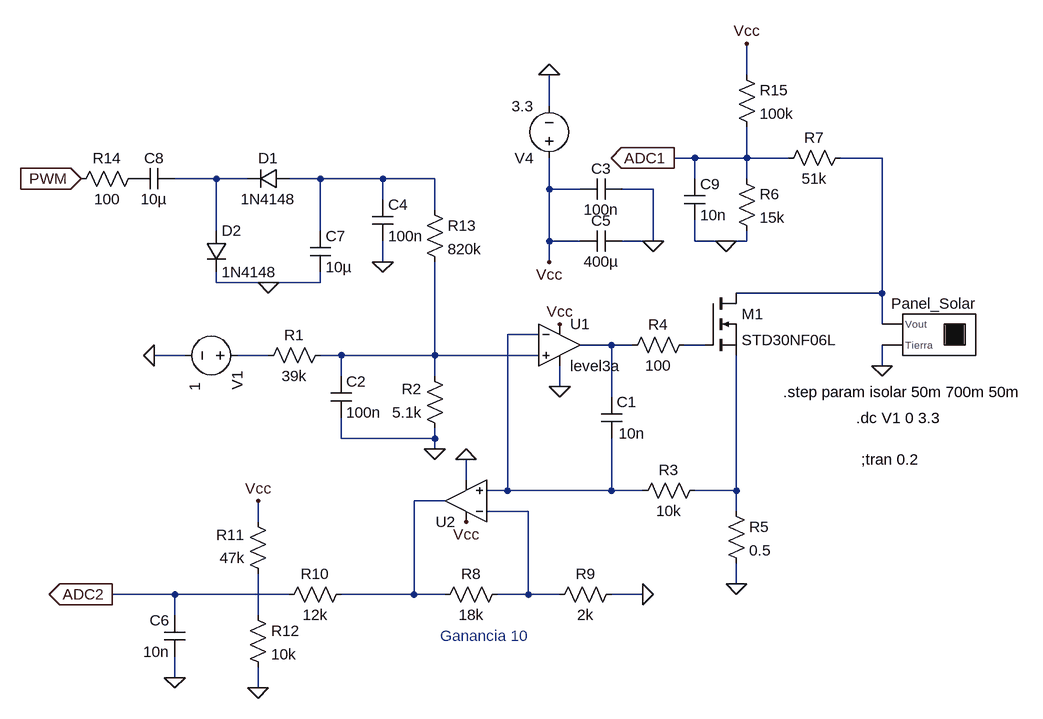
[diagram p0: schematic Carga activa(1).asc]
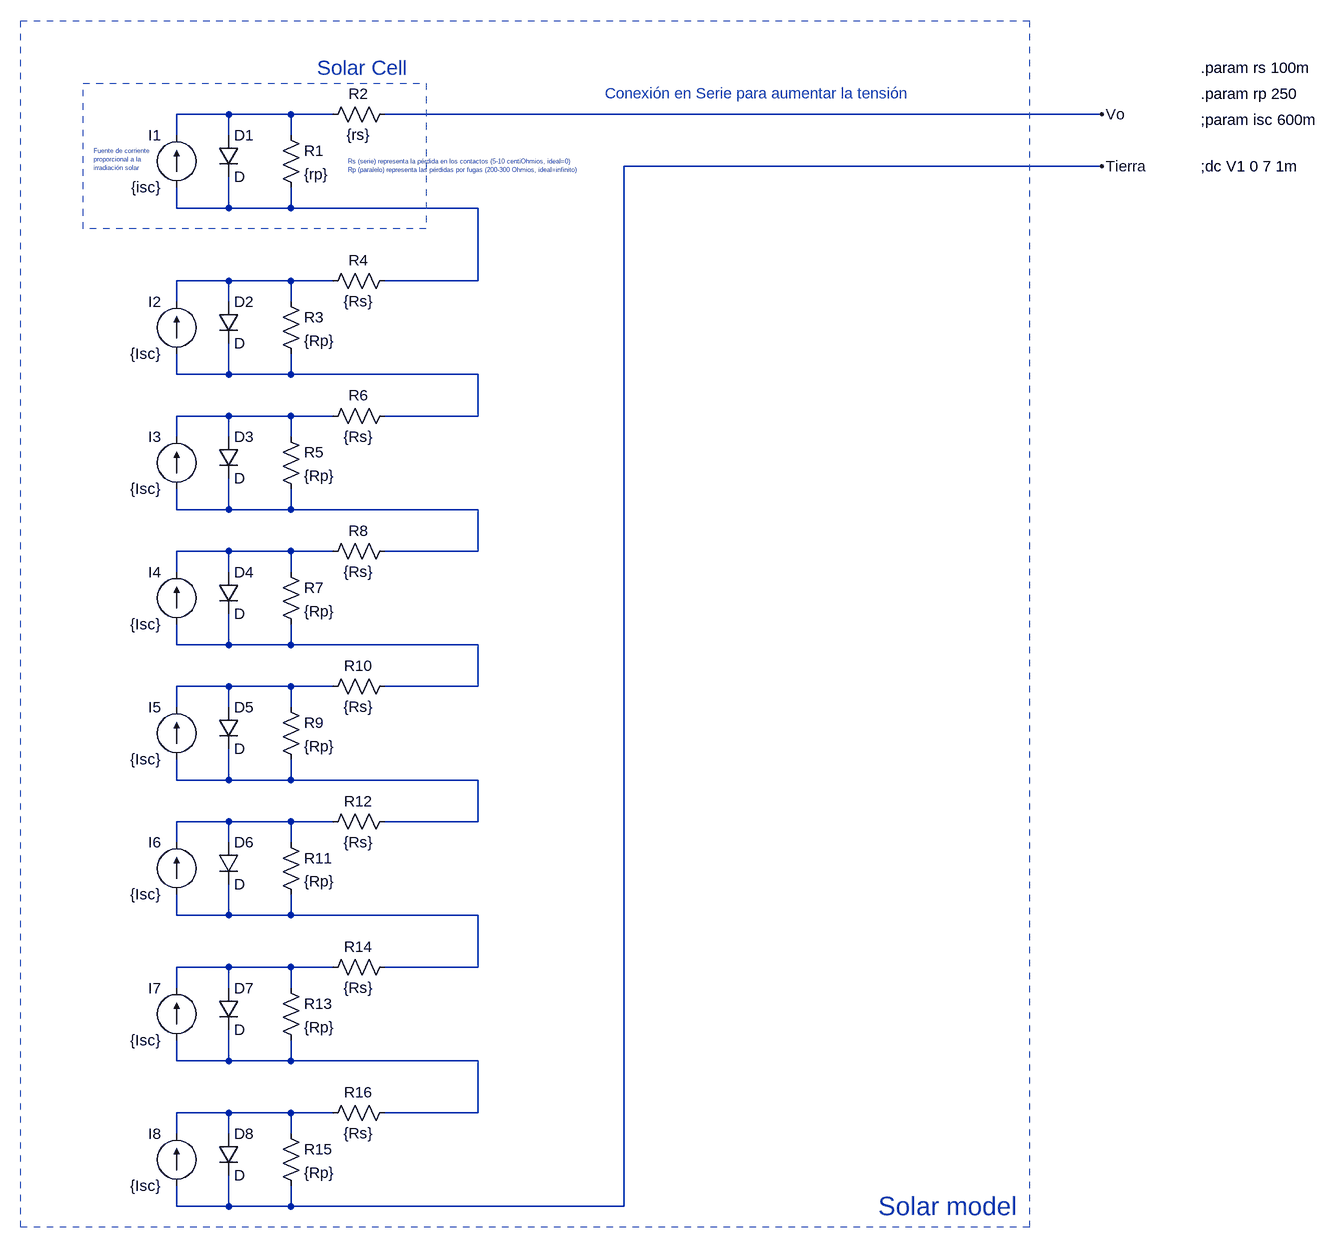
[diagram p1: sub-circuit solar_model.asc]
Carga activa(1).asc, the LTspice schematic file:
Version 4
SHEET 1 2576 680
WIRE 608 -320 608 -368
WIRE 304 -272 304 -320
WIRE 528 -192 496 -192
WIRE 608 -192 608 -240
WIRE 608 -192 528 -192
WIRE 672 -192 608 -192
WIRE 816 -192 752 -192
WIRE -208 -160 -272 -160
WIRE -160 -160 -208 -160
WIRE -48 -160 -96 -160
WIRE 48 -160 -48 -160
WIRE 128 -160 48 -160
WIRE 528 -160 528 -192
WIRE 608 -160 608 -192
WIRE 304 -144 304 -192
WIRE 352 -144 304 -144
WIRE 464 -144 416 -144
WIRE 48 -128 48 -160
WIRE 128 -112 128 -160
WIRE -208 -80 -208 -160
WIRE -48 -80 -48 -160
WIRE 304 -64 304 -144
WIRE 352 -64 304 -64
WIRE 464 -64 464 -144
WIRE 464 -64 416 -64
WIRE 528 -64 528 -96
WIRE 576 -64 528 -64
WIRE 608 -64 608 -80
WIRE 608 -64 576 -64
WIRE 48 -32 48 -64
WIRE 304 -32 304 -64
WIRE -208 0 -208 -16
WIRE -128 0 -208 0
WIRE -48 0 -48 -16
WIRE -48 0 -128 0
WIRE 816 16 816 -192
WIRE 816 16 592 16
WIRE 816 64 816 16
WIRE 288 80 240 80
WIRE 400 96 352 96
WIRE 432 96 400 96
WIRE 544 96 512 96
WIRE -256 112 -304 112
WIRE -128 112 -176 112
WIRE -16 112 -48 112
WIRE 128 112 128 -32
WIRE 128 112 -16 112
WIRE 288 112 128 112
WIRE 816 128 816 96
WIRE -16 144 -16 112
WIRE 128 144 128 112
WIRE 320 160 320 128
WIRE 400 176 400 96
WIRE -16 240 -16 208
WIRE 128 240 128 224
WIRE 128 240 -16 240
WIRE 128 256 128 240
WIRE 176 304 176 272
WIRE 240 320 240 80
WIRE 240 320 208 320
WIRE 400 320 400 240
WIRE 400 320 240 320
WIRE 448 320 400 320
WIRE 592 320 592 112
WIRE 592 320 528 320
WIRE 144 336 96 336
WIRE 272 352 208 352
WIRE 592 352 592 320
WIRE -144 368 -144 336
WIRE 592 464 592 432
WIRE -272 480 -368 480
WIRE -96 480 -272 480
WIRE 96 480 96 336
WIRE 96 480 -16 480
WIRE 144 480 96 480
WIRE 272 480 272 352
WIRE 272 480 224 480
WIRE 320 480 272 480
WIRE 448 480 400 480
WIRE -272 512 -272 480
WIRE -144 512 -144 448
WIRE -272 608 -272 576
WIRE -144 624 -144 592
FLAG -304 112 0
FLAG 128 256 0
FLAG 816 128 0
FLAG 576 -64 0
FLAG 320 160 0
FLAG 304 -320 0
FLAG 496 -192 ADC1
IOPIN 496 -192 Out
FLAG 320 64 Vcc
FLAG 304 -32 Vcc
FLAG 448 480 0
FLAG -368 480 ADC2
IOPIN -368 480 Out
FLAG 592 464 0
FLAG 176 272 0
FLAG 176 368 Vcc
FLAG -144 624 0
FLAG 464 -64 0
FLAG -128 0 0
FLAG -272 608 0
FLAG -416 -160 PWM
IOPIN -416 -160 In
FLAG -144 336 Vcc
FLAG 48 -32 0
FLAG 608 -368 Vcc
SYMBOL res -32 96 R90
WINDOW 0 0 56 VBottom 2
WINDOW 3 32 56 VTop 2
SYMATTR InstName R1
SYMATTR Value 39k
SYMBOL res 144 240 R180
WINDOW 0 36 76 Left 2
WINDOW 3 36 40 Left 2
SYMATTR InstName R2
SYMATTR Value 5.1k
SYMBOL voltage -160 112 R90
WINDOW 123 0 0 Left 0
WINDOW 39 0 0 Left 0
WINDOW 3 42 81 Left 2
SYMATTR Value 1
SYMATTR InstName V1
SYMBOL res 544 304 R90
WINDOW 0 0 56 VBottom 2
WINDOW 3 32 56 VTop 2
SYMATTR InstName R3
SYMATTR Value 10k
SYMBOL res 528 80 R90
WINDOW 0 0 56 VBottom 2
WINDOW 3 32 56 VTop 2
SYMATTR InstName R4
SYMATTR Value 100
SYMBOL nmos 544 16 R0
SYMATTR InstName M1
SYMATTR Value STD30NF06L
SYMBOL res 592 -176 R0
SYMATTR InstName R6
SYMATTR Value 15k
SYMBOL res 656 -176 R270
WINDOW 0 32 56 VTop 2
WINDOW 3 0 56 VBottom 2
SYMATTR InstName R7
SYMATTR Value 51k
SYMBOL voltage 304 -176 R180
WINDOW 123 0 0 Left 0
WINDOW 39 0 0 Left 0
SYMATTR InstName V4
SYMATTR Value 3.3
SYMBOL cap 384 176 R0
WINDOW 3 27 56 Left 2
SYMATTR Value 10n
SYMATTR InstName C1
SYMBOL cap -32 144 R0
SYMATTR InstName C2
SYMATTR Value 100n
SYMBOL cap 416 -160 R90
WINDOW 0 0 32 VBottom 2
WINDOW 3 32 32 VTop 2
SYMATTR InstName C3
SYMATTR Value 100n
SYMBOL res 240 464 R90
WINDOW 0 0 56 VBottom 2
WINDOW 3 32 56 VTop 2
SYMATTR InstName R8
SYMATTR Value 18k
SYMBOL res 416 464 R90
WINDOW 0 0 56 VBottom 2
WINDOW 3 32 56 VTop 2
SYMATTR InstName R9
SYMATTR Value 2k
SYMBOL res 576 336 R0
SYMATTR InstName R5
SYMATTR Value 0.5
SYMBOL Opamps\\UniversalOpamp 176 336 R180
SYMATTR InstName U2
SYMBOL Opamps\\UniversalOpamp3 320 96 R0
SYMATTR InstName U1
SYMBOL Solar_model 896 80 R0
SYMATTR InstName Panel_Solar
SYMATTR SpiceLine isc=isolar
SYMBOL res 0 464 R90
WINDOW 0 0 56 VBottom 2
WINDOW 3 32 56 VTop 2
SYMATTR InstName R10
SYMATTR Value 12k
SYMBOL res -128 464 R180
WINDOW 0 36 76 Left 2
WINDOW 3 36 40 Left 2
SYMATTR InstName R11
SYMATTR Value 47k
SYMBOL res -160 496 R0
SYMATTR InstName R12
SYMATTR Value 10k
SYMBOL cap 416 -80 R90
WINDOW 0 0 32 VBottom 2
WINDOW 3 32 32 VTop 2
SYMATTR InstName C5
SYMATTR Value 400µ
SYMBOL cap -256 576 R180
WINDOW 0 24 56 Left 2
WINDOW 3 24 8 Left 2
SYMATTR InstName C6
SYMATTR Value 10n
SYMBOL res 112 -128 R0
SYMATTR InstName R13
SYMATTR Value 820k
SYMBOL cap -64 -80 R0
SYMATTR InstName C7
SYMATTR Value 10µ
SYMBOL diode -96 -176 R90
WINDOW 0 0 32 VBottom 2
WINDOW 3 32 32 VTop 2
SYMATTR InstName D1
SYMATTR Value 1N4148
SYMBOL diode -224 -80 R0
SYMATTR InstName D2
SYMATTR Value 1N4148
SYMBOL cap -272 -176 R90
WINDOW 0 0 32 VBottom 2
WINDOW 3 32 32 VTop 2
SYMATTR InstName C8
SYMATTR Value 10µ
SYMBOL res -320 -176 R90
WINDOW 0 0 56 VBottom 2
WINDOW 3 32 56 VTop 2
SYMATTR InstName R14
SYMATTR Value 100
SYMBOL cap 32 -128 R0
SYMATTR InstName C4
SYMATTR Value 100n
SYMBOL cap 512 -160 R0
SYMATTR InstName C9
SYMATTR Value 10n
SYMBOL res 592 -336 R0
SYMATTR InstName R15
SYMATTR Value 100k
TEXT 776 208 Left 2 !.dc V1 0 3.3
TEXT 784 272 Left 2 !;tran 0.2
TEXT 136 544 Left 2 ;Ganancia 10
TEXT 664 168 Left 2 !.step param isolar 50m 700m 50m

solar_model.asc, the sub-circuit schematic file:
Version 4
SHEET 1 1732 1608
WIRE -192 -144 -272 -144
WIRE -96 -144 -192 -144
WIRE -32 -144 -96 -144
WIRE 1152 -144 48 -144
WIRE -272 -112 -272 -144
WIRE -192 -112 -192 -144
WIRE -96 -112 -96 -144
WIRE 1152 -64 416 -64
WIRE -272 0 -272 -32
WIRE -192 0 -192 -48
WIRE -192 0 -272 0
WIRE -96 0 -96 -32
WIRE -96 0 -192 0
WIRE 192 0 -96 0
WIRE -192 112 -272 112
WIRE -96 112 -192 112
WIRE -32 112 -96 112
WIRE 192 112 192 0
WIRE 192 112 48 112
WIRE -272 144 -272 112
WIRE -192 144 -192 112
WIRE -96 144 -96 112
WIRE -272 256 -272 224
WIRE -192 256 -192 208
WIRE -192 256 -272 256
WIRE -96 256 -96 224
WIRE -96 256 -192 256
WIRE 192 256 -96 256
WIRE -192 320 -272 320
WIRE -96 320 -192 320
WIRE -32 320 -96 320
WIRE 192 320 192 256
WIRE 192 320 48 320
WIRE -272 352 -272 320
WIRE -192 352 -192 320
WIRE -96 352 -96 320
WIRE -272 464 -272 432
WIRE -192 464 -192 416
WIRE -192 464 -272 464
WIRE -96 464 -96 432
WIRE -96 464 -192 464
WIRE 192 464 -96 464
WIRE -192 528 -272 528
WIRE -96 528 -192 528
WIRE -32 528 -96 528
WIRE 192 528 192 464
WIRE 192 528 48 528
WIRE -272 560 -272 528
WIRE -192 560 -192 528
WIRE -96 560 -96 528
WIRE -272 672 -272 640
WIRE -192 672 -192 624
WIRE -192 672 -272 672
WIRE -96 672 -96 640
WIRE -96 672 -192 672
WIRE 192 672 -96 672
WIRE -192 736 -272 736
WIRE -96 736 -192 736
WIRE -32 736 -96 736
WIRE 192 736 192 672
WIRE 192 736 48 736
WIRE -272 768 -272 736
WIRE -192 768 -192 736
WIRE -96 768 -96 736
WIRE -272 880 -272 848
WIRE -192 880 -192 832
WIRE -192 880 -272 880
WIRE -96 880 -96 848
WIRE -96 880 -192 880
WIRE 192 880 -96 880
WIRE -192 944 -272 944
WIRE -96 944 -192 944
WIRE -32 944 -96 944
WIRE 192 944 192 880
WIRE 192 944 48 944
WIRE -272 976 -272 944
WIRE -192 976 -192 944
WIRE -96 976 -96 944
WIRE -272 1088 -272 1056
WIRE -192 1088 -192 1040
WIRE -192 1088 -272 1088
WIRE -96 1088 -96 1056
WIRE -96 1088 -192 1088
WIRE 192 1088 -96 1088
WIRE -192 1168 -272 1168
WIRE -96 1168 -192 1168
WIRE -32 1168 -96 1168
WIRE 192 1168 192 1088
WIRE 192 1168 48 1168
WIRE -272 1200 -272 1168
WIRE -192 1200 -192 1168
WIRE -96 1200 -96 1168
WIRE -272 1312 -272 1280
WIRE -192 1312 -192 1264
WIRE -192 1312 -272 1312
WIRE -96 1312 -96 1280
WIRE -96 1312 -192 1312
WIRE 192 1312 -96 1312
WIRE -192 1392 -272 1392
WIRE -96 1392 -192 1392
WIRE -32 1392 -96 1392
WIRE 192 1392 192 1312
WIRE 192 1392 48 1392
WIRE -272 1424 -272 1392
WIRE -192 1424 -192 1392
WIRE -96 1424 -96 1392
WIRE -272 1536 -272 1504
WIRE -192 1536 -192 1488
WIRE -192 1536 -272 1536
WIRE -96 1536 -96 1504
WIRE -96 1536 -192 1536
WIRE 416 1536 416 -64
WIRE 416 1536 -96 1536
FLAG 1152 -144 Vo
FLAG 1152 -64 Tierra
SYMBOL current -272 -32 R180
WINDOW 0 24 80 Left 2
WINDOW 3 24 0 Left 2
WINDOW 123 0 0 Left 0
WINDOW 39 0 0 Left 0
SYMATTR InstName I1
SYMATTR Value {isc}
SYMBOL diode -208 -112 R0
SYMATTR InstName D1
SYMBOL res -112 -128 R0
SYMATTR InstName R1
SYMATTR Value {rp}
SYMBOL res 64 -160 R90
WINDOW 0 0 56 VBottom 2
WINDOW 3 32 56 VTop 2
SYMATTR InstName R2
SYMATTR Value {rs}
SYMBOL current -272 224 R180
WINDOW 0 24 80 Left 2
WINDOW 3 24 0 Left 2
WINDOW 123 0 0 Left 0
WINDOW 39 0 0 Left 0
SYMATTR InstName I2
SYMATTR Value {Isc}
SYMBOL diode -208 144 R0
SYMATTR InstName D2
SYMBOL res -112 128 R0
SYMATTR InstName R3
SYMATTR Value {Rp}
SYMBOL res 64 96 R90
WINDOW 0 0 56 VBottom 2
WINDOW 3 32 56 VTop 2
SYMATTR InstName R4
SYMATTR Value {Rs}
SYMBOL current -272 432 R180
WINDOW 0 24 80 Left 2
WINDOW 3 24 0 Left 2
WINDOW 123 0 0 Left 0
WINDOW 39 0 0 Left 0
SYMATTR InstName I3
SYMATTR Value {Isc}
SYMBOL diode -208 352 R0
SYMATTR InstName D3
SYMBOL res -112 336 R0
SYMATTR InstName R5
SYMATTR Value {Rp}
SYMBOL res 64 304 R90
WINDOW 0 0 56 VBottom 2
WINDOW 3 32 56 VTop 2
SYMATTR InstName R6
SYMATTR Value {Rs}
SYMBOL current -272 640 R180
WINDOW 0 24 80 Left 2
WINDOW 3 24 0 Left 2
WINDOW 123 0 0 Left 0
WINDOW 39 0 0 Left 0
SYMATTR InstName I4
SYMATTR Value {Isc}
SYMBOL diode -208 560 R0
SYMATTR InstName D4
SYMBOL res -112 544 R0
SYMATTR InstName R7
SYMATTR Value {Rp}
SYMBOL res 64 512 R90
WINDOW 0 0 56 VBottom 2
WINDOW 3 32 56 VTop 2
SYMATTR InstName R8
SYMATTR Value {Rs}
SYMBOL current -272 848 R180
WINDOW 0 24 80 Left 2
WINDOW 3 24 0 Left 2
WINDOW 123 0 0 Left 0
WINDOW 39 0 0 Left 0
SYMATTR InstName I5
SYMATTR Value {Isc}
SYMBOL diode -208 768 R0
SYMATTR InstName D5
SYMBOL res -112 752 R0
SYMATTR InstName R9
SYMATTR Value {Rp}
SYMBOL res 64 720 R90
WINDOW 0 0 56 VBottom 2
WINDOW 3 32 56 VTop 2
SYMATTR InstName R10
SYMATTR Value {Rs}
SYMBOL current -272 1056 R180
WINDOW 0 24 80 Left 2
WINDOW 3 24 0 Left 2
WINDOW 123 0 0 Left 0
WINDOW 39 0 0 Left 0
SYMATTR InstName I6
SYMATTR Value {Isc}
SYMBOL diode -208 976 R0
SYMATTR InstName D6
SYMBOL res -112 960 R0
SYMATTR InstName R11
SYMATTR Value {Rp}
SYMBOL res 64 928 R90
WINDOW 0 0 56 VBottom 2
WINDOW 3 32 56 VTop 2
SYMATTR InstName R12
SYMATTR Value {Rs}
SYMBOL current -272 1280 R180
WINDOW 0 24 80 Left 2
WINDOW 3 24 0 Left 2
WINDOW 123 0 0 Left 0
WINDOW 39 0 0 Left 0
SYMATTR InstName I7
SYMATTR Value {Isc}
SYMBOL diode -208 1200 R0
SYMATTR InstName D7
SYMBOL res -112 1184 R0
SYMATTR InstName R13
SYMATTR Value {Rp}
SYMBOL res 64 1152 R90
WINDOW 0 0 56 VBottom 2
WINDOW 3 32 56 VTop 2
SYMATTR InstName R14
SYMATTR Value {Rs}
SYMBOL current -272 1504 R180
WINDOW 0 24 80 Left 2
WINDOW 3 24 0 Left 2
WINDOW 123 0 0 Left 0
WINDOW 39 0 0 Left 0
SYMATTR InstName I8
SYMATTR Value {Isc}
SYMBOL diode -208 1424 R0
SYMATTR InstName D8
SYMBOL res -112 1408 R0
SYMATTR InstName R15
SYMATTR Value {Rp}
SYMBOL res 64 1376 R90
WINDOW 0 0 56 VBottom 2
WINDOW 3 32 56 VTop 2
SYMATTR InstName R16
SYMATTR Value {Rs}
TEXT 1304 -216 Left 2 !.param rs 100m
TEXT 1304 -176 Left 2 !.param rp 250
TEXT 1304 -136 Left 2 !;param isc 600m
TEXT -56 -216 Left 3 ;Solar Cell
TEXT -8 -72 Left 0 ;Rs (serie) representa la pérdida en los contactos (5-10 centiOhmios, ideal=0)\nRp (paralelo) representa las pérdidas por fugas (200-300 Ohmios, ideal=infinito)
TEXT -400 -88 Left 0 ;Fuente de corriente\nproporcional a la \nirradiación solar
TEXT 808 1536 Left 4 ;Solar model
TEXT 1304 -64 Left 2 !;dc V1 0 7 1m
TEXT 624 -192 Top 2 ;Conexión en Serie para aumentar la tensión
RECTANGLE Normal 112 32 -416 -192 1
RECTANGLE Normal 1040 1568 -512 -288 2

The netlist it stands for:
* Carga activa(1).asc
R1 N008 N007 39k
R2 0 N008 5.1k
V1 N007 0 1
R3 N009 N004 10k
R4 N006 N005 100
M1 N001 N006 N009 N009 STD30NF06L
R6 ADC1 0 15k
R7 ADC1 N001 51k
V4 Vcc 0 3.3
C1 N005 N004 10n
C2 N008 0 100n
C3 0 Vcc 100n
R8 N011 N010 18k
R9 0 N011 2k
R5 N009 0 0.5
XU2 N004 N011 Vcc 0 N010 level1 Avol=1Meg GBW=10Meg Vos=0 En=0 Enk=0 In=0 Ink=0 Rin=500Meg  ; pins In+ In- V+ V- OUT
XU1 N008 N004 Vcc 0 N005 level3a  ; pins In+ In- V+ V- OUT
XPanel_Solar N001 0 solar_model params: isc=isolar
R10 N010 ADC2 12k
R11 N012 Vcc 47k
R12 N012 0 10k
C5 0 Vcc 400µ
C6 0 ADC2 10n
R13 N003 N008 820k
C7 N003 0 10µ
D1 N003 N002 1N4148
D2 N002 0 1N4148
C8 N002 P001 10µ
R14 P001 PWM 100
C4 N003 0 100n
C9 ADC1 0 10n
R15 Vcc ADC1 100k

* block symbol definitions
.subckt solar_model Vo Tierra
I1 N002 N001 {isc}
D1 N001 N002 D
R1 N001 N002 {rp}
R2 Vo N001 {rs}
I2 N004 N003 {Isc}
D2 N003 N004 D
R3 N003 N004 {Rp}
R4 N002 N003 {Rs}
I3 N006 N005 {Isc}
D3 N005 N006 D
R5 N005 N006 {Rp}
R6 N004 N005 {Rs}
I4 N008 N007 {Isc}
D4 N007 N008 D
R7 N007 N008 {Rp}
R8 N006 N007 {Rs}
I5 N010 N009 {Isc}
D5 N009 N010 D
R9 N009 N010 {Rp}
R10 N008 N009 {Rs}
I6 N012 N011 {Isc}
D6 N011 N012 D
R11 N011 N012 {Rp}
R12 N010 N011 {Rs}
I7 N014 N013 {Isc}
D7 N013 N014 D
R13 N013 N014 {Rp}
R14 N012 N013 {Rs}
I8 Tierra N015 {Isc}
D8 N015 Tierra D
R15 N015 Tierra {Rp}
R16 N014 N015 {Rs}
.param rs 100m
.param rp 250
;param isc 600m
* Solar Cell
* Rs (serie) representa la pérdida en los contactos (5-10 centiOhmios, ideal=0)
* Rp (paralelo) representa las pérdidas por fugas (200-300 Ohmios, ideal=infinito)
* Fuente de corriente
* proporcional a la
* irradiación solar
* Solar model
;dc V1 0 7 1m
* Conexión en Serie para aumentar la tensión
.ends solar_model

.model D D
.lib standard.dio
.model NMOS NMOS
.model PMOS PMOS
.lib standard.mos
.dc V1 0 3.3
;tran 0.2
* Ganancia 10
.step param isolar 50m 700m 50m
.lib UniversalOpAmp1.lib
.backanno
.end

* Results of the author's LTspice run, read from the files saved beside the schematic
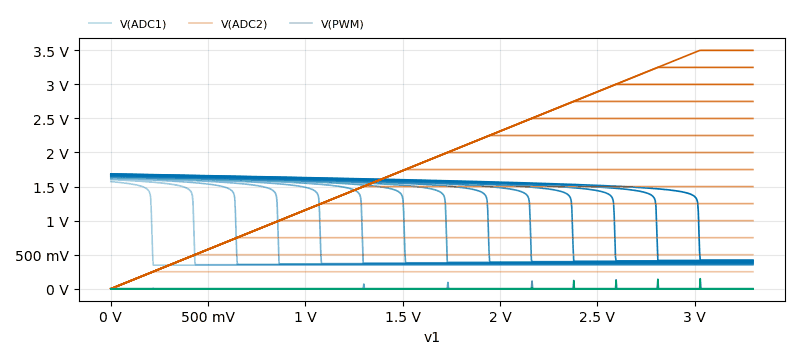
[diagram p2: DC transfer characteristic of Carga activa(1).asc, plotted from the saved traces]
* DC transfer characteristic, 14 runs:
*   V(ADC1) [isolar=0.05]: 1.572 V at v1=0 V, 348.3 mV at v1=3.3 V, min 348.3 mV, max 1.572 V
*   V(ADC1) [isolar=0.1]: 1.603 V at v1=0 V, 353.8 mV at v1=3.3 V, min 353.8 mV, max 1.603 V
*   V(ADC1) [isolar=0.15]: 1.62 V at v1=0 V, 359.3 mV at v1=3.3 V, min 359.3 mV, max 1.62 V
*   V(ADC1) [isolar=0.2]: 1.633 V at v1=0 V, 364.8 mV at v1=3.3 V, min 364.8 mV, max 1.633 V
*   V(ADC1) [isolar=0.25]: 1.642 V at v1=0 V, 370.3 mV at v1=3.3 V, min 370.3 mV, max 1.642 V
*   V(ADC1) [isolar=0.3]: 1.65 V at v1=0 V, 375.8 mV at v1=3.3 V, min 375.8 mV, max 1.65 V
*   V(ADC1) [isolar=0.35]: 1.657 V at v1=0 V, 381.4 mV at v1=3.3 V, min 381.4 mV, max 1.657 V
*   V(ADC1) [isolar=0.4]: 1.662 V at v1=0 V, 387 mV at v1=3.3 V, min 387 mV, max 1.662 V
*   V(ADC2) [isolar=0.05]: 600.6 µV at v1=0 V, 250.5 mV at v1=3.3 V, min 600.6 µV, max 250.5 mV
*   V(ADC2) [isolar=0.1]: 600.6 µV at v1=0 V, 500.3 mV at v1=3.3 V, min 600.6 µV, max 500.3 mV
*   V(ADC2) [isolar=0.15]: 600.6 µV at v1=0 V, 750.1 mV at v1=3.3 V, min 600.6 µV, max 750.1 mV
*   V(ADC2) [isolar=0.2]: 600.6 µV at v1=0 V, 999.9 mV at v1=3.3 V, min 600.6 µV, max 999.9 mV
*   V(ADC2) [isolar=0.25]: 600.6 µV at v1=0 V, 1.25 V at v1=3.3 V, min 600.6 µV, max 1.25 V
*   V(ADC2) [isolar=0.3]: 600.6 µV at v1=0 V, 1.5 V at v1=3.3 V, min 600.6 µV, max 1.5 V
*   V(ADC2) [isolar=0.35]: 600.6 µV at v1=0 V, 1.749 V at v1=3.3 V, min 600.6 µV, max 1.749 V
*   V(ADC2) [isolar=0.4]: 600.6 µV at v1=0 V, 1.999 V at v1=3.3 V, min 600.6 µV, max 1.999 V
*   V(PWM) [isolar=0.05]: 72.75 pV at v1=0 V, 1.579 µV at v1=3.3 V, min 72.75 pV, max 12.25 mV
*   V(PWM) [isolar=0.1]: 72.75 pV at v1=0 V, 1.579 µV at v1=3.3 V, min 72.75 pV, max 1.579 µV
*   V(PWM) [isolar=0.15]: 72.75 pV at v1=0 V, 1.579 µV at v1=3.3 V, min 72.75 pV, max 1.579 µV
*   V(PWM) [isolar=0.2]: 72.75 pV at v1=0 V, 1.579 µV at v1=3.3 V, min 72.75 pV, max 1.579 µV
*   V(PWM) [isolar=0.25]: 72.75 pV at v1=0 V, 1.579 µV at v1=3.3 V, min 72.75 pV, max 1.579 µV
*   V(PWM) [isolar=0.3]: 72.75 pV at v1=0 V, 1.579 µV at v1=3.3 V, min 72.75 pV, max 71.15 mV
*   V(PWM) [isolar=0.35]: 72.75 pV at v1=0 V, 1.579 µV at v1=3.3 V, min 72.75 pV, max 1.579 µV
*   V(PWM) [isolar=0.4]: 72.75 pV at v1=0 V, 1.579 µV at v1=3.3 V, min 72.75 pV, max 93.03 mV